# EAGLE design tin_of_fets (EAGLE 7.7.0)
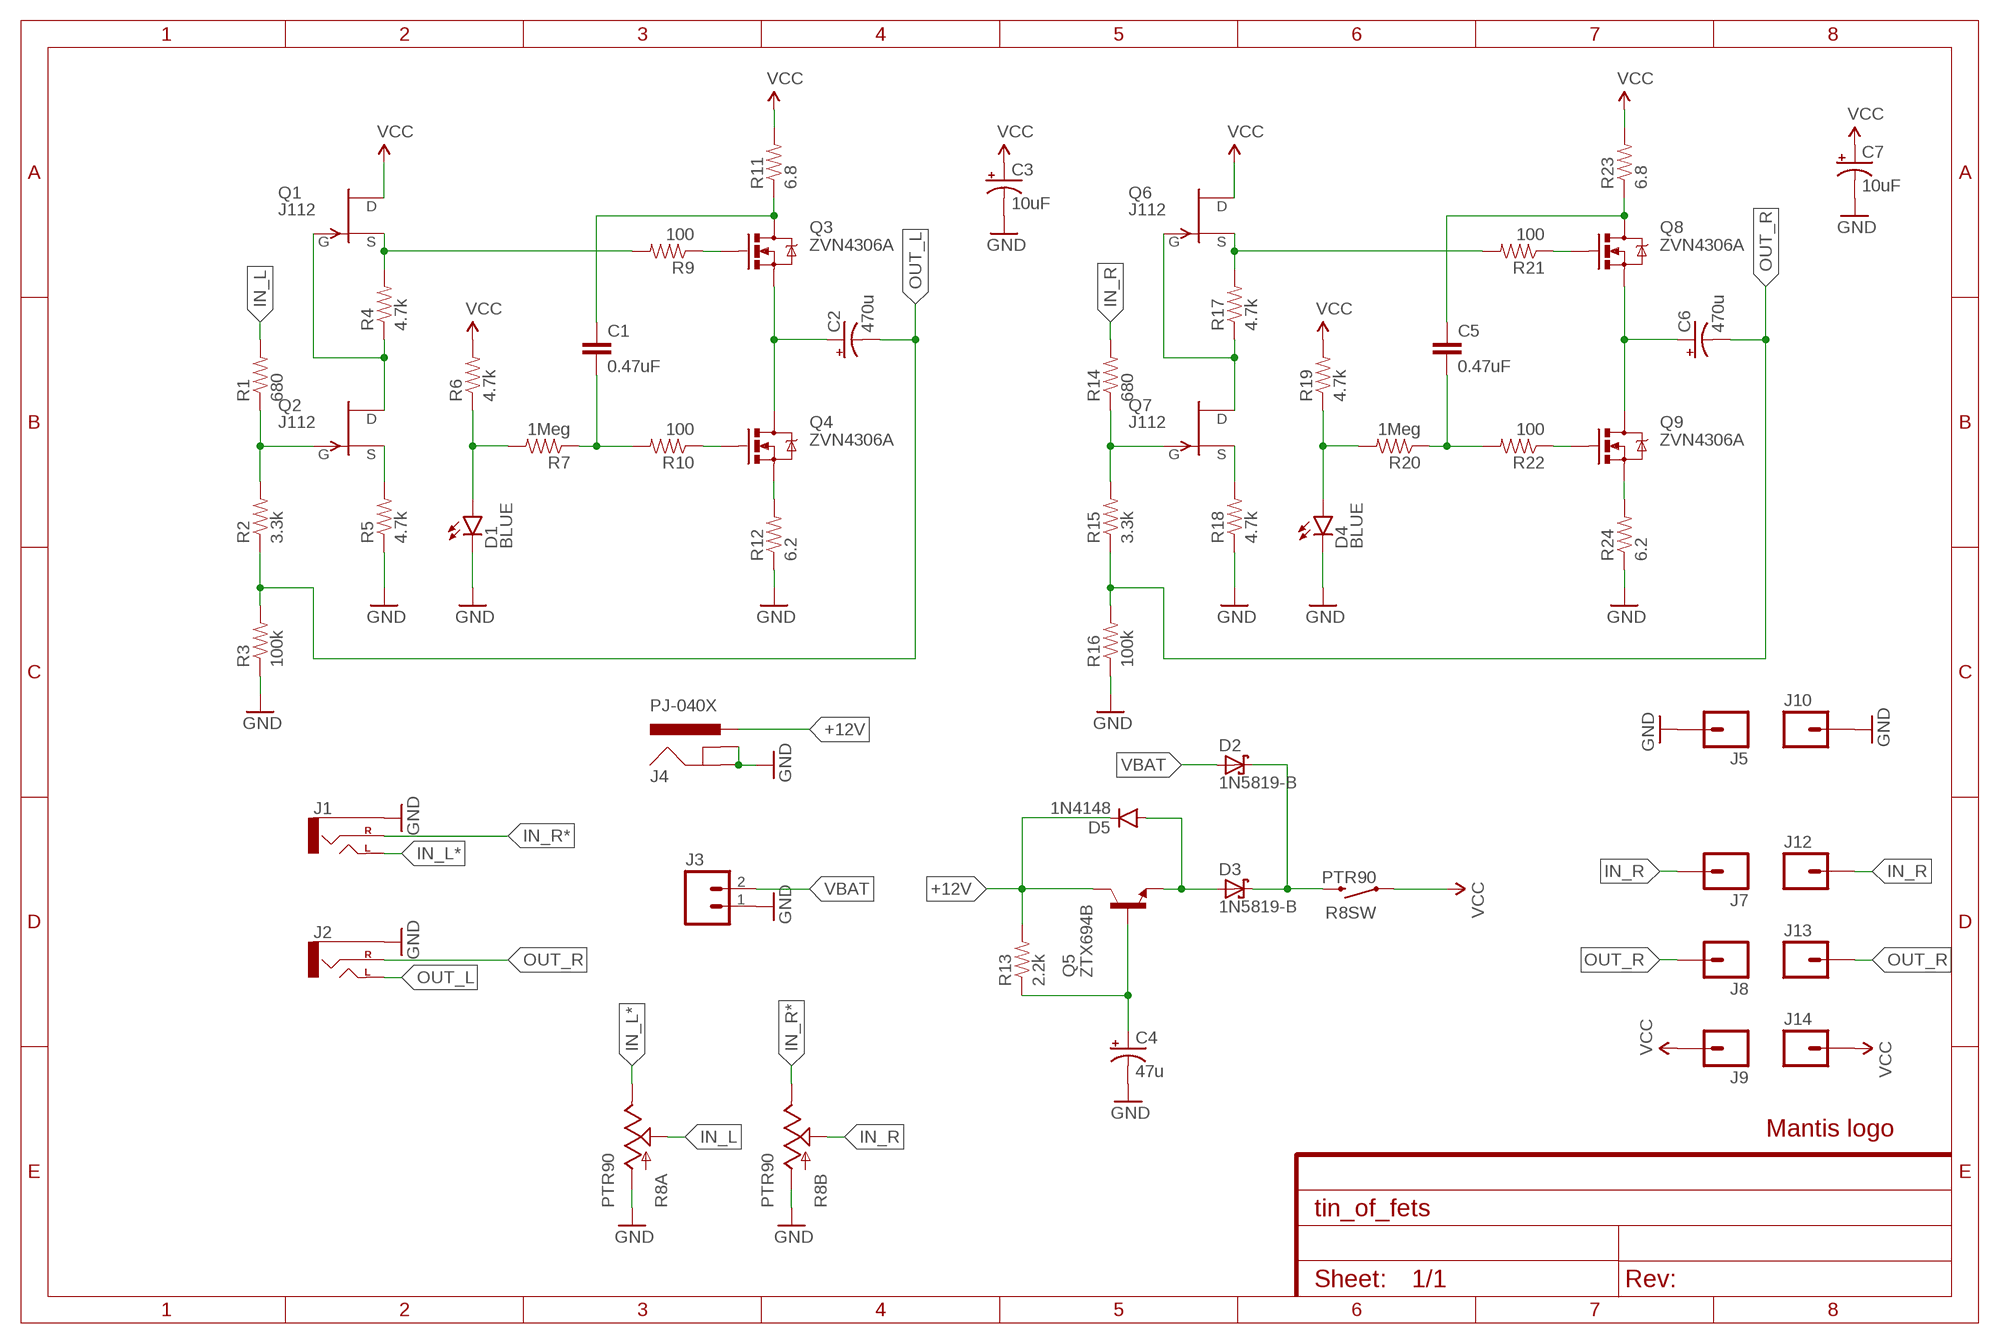
[diagram p0: schematic, sheet 1]

## Parts
C1  0.47uF  C5/3.5  [C5B3.5]
C2  470u  CAP_POLPTH8MM  [CPOL-RADIAL-8/3.5]
C3  10uF  CAP_POLPTH1-SM  [CPOL-RADIAL-10UF-25V-SM]
C4  47u  CAP_POLPTH1-SM  [CPOL-RADIAL-10UF-25V-SM]
C5  0.47uF  C5/3.5  [C5B3.5]
C6  470u  CAP_POLPTH8MM  [CPOL-RADIAL-8/3.5]
C7  10uF  CAP_POLPTH1-SM  [CPOL-RADIAL-10UF-25V-SM]
D1  BLUE  LED3MM-SM  [LED3MM-SM]
D2  1N5819-B  [DO41-7.6]
D3  1N5819-B  [DO41-7.6]
D4  BLUE  LED3MM-SM  [LED3MM-SM]
D5  1N4148  DIODE1N4148  [DIODE-1N4148]
J1  AUDIO-JACKPTH  [AUDIO-JACK]
J2  AUDIO-JACKPTH  [AUDIO-JACK]
J3  M02PTH  [1X02]
J4  PJ-040X  [PJ-040X]
J5  M01PTH  [1X01]
J7  M01PTH  [1X01]
J8  M01PTH  [1X01]
J9  M01PTH  [1X01]
J10  M01PTH  [1X01]
J12  M01PTH  [1X01]
J13  M01PTH  [1X01]
J14  M01PTH  [1X01]
LOGO1  LOGO-MANTIS  [LOGO-MANTIS]
Q1  J112  [TO-92]
Q2  J112  [TO-92]
Q3  ZVN4306A  [TO-92]
Q4  ZVN4306A  [TO-92]
Q5  ZTX694B  [TO-92]
Q6  J112  [TO-92]
Q7  J112  [TO-92]
Q8  ZVN4306A  [TO-92]
Q9  ZVN4306A  [TO-92]
R1  680  RESISTORPTH-1/4W-SM  [AXIAL-0.4-SM]
R2  3.3k  RESISTORPTH-1/4W-SM  [AXIAL-0.4-SM]
R3  100k  RESISTORPTH-1/4W-SM  [AXIAL-0.4-SM]
R4  4.7k  RESISTORPTH-1/4W-SM  [AXIAL-0.4-SM]
R5  4.7k  RESISTORPTH-1/4W-SM  [AXIAL-0.4-SM]
R6  4.7k  RESISTORPTH-1/4W-SM  [AXIAL-0.4-SM]
R7  1Meg  RESISTORPTH-1/4W-SM  [AXIAL-0.4-SM]
R8  PTR90  [PTR902]
R9  100  RESISTORPTH-1/4W-SM  [AXIAL-0.4-SM]
R10  100  RESISTORPTH-1/4W-SM  [AXIAL-0.4-SM]
R11  6.8  RESISTORPTH-1/4W-SM  [AXIAL-0.4-SM]
R12  6.2  RESISTORPTH-1/4W-SM  [AXIAL-0.4-SM]
R13  2.2k  RESISTORPTH-1/4W-SM  [AXIAL-0.4-SM]
R14  680  RESISTORPTH-1/4W-SM  [AXIAL-0.4-SM]
R15  3.3k  RESISTORPTH-1/4W-SM  [AXIAL-0.4-SM]
R16  100k  RESISTORPTH-1/4W-SM  [AXIAL-0.4-SM]
R17  4.7k  RESISTORPTH-1/4W-SM  [AXIAL-0.4-SM]
R18  4.7k  RESISTORPTH-1/4W-SM  [AXIAL-0.4-SM]
R19  4.7k  RESISTORPTH-1/4W-SM  [AXIAL-0.4-SM]
R20  1Meg  RESISTORPTH-1/4W-SM  [AXIAL-0.4-SM]
R21  100  RESISTORPTH-1/4W-SM  [AXIAL-0.4-SM]
R22  100  RESISTORPTH-1/4W-SM  [AXIAL-0.4-SM]
R23  6.8  RESISTORPTH-1/4W-SM  [AXIAL-0.4-SM]
R24  6.2  RESISTORPTH-1/4W-SM  [AXIAL-0.4-SM]

## Nets
+12V [pwr]: D5.C J4.1(PWR) Q5.3(C) R13.P$2
GND: C3.2(-) C4.2(-) C7.2(-) D1.K(C) D4.K(C) J1.SLEEVE J2.SLEEVE J3.1 J4.2(GND) J4.3(GNDBREAK) J5.1 J10.1 R3.P$1 R5.P$1 R8.R1.1(A:A) R8.R2.1(B:A) R12.P$1 R16.P$1 R18.P$1 R24.P$1
IN_L: R1.P$2 R8.R1.2(A:S)
IN_L*: J1.TIP(LEFT) R8.R1.3(A:E)
IN_R: J7.1 J12.1 R8.R2.2(B:S) R14.P$2
IN_R*: J1.RING(RIGHT) R8.R2.3(B:E)
N$1: Q1.2(S) R4.P$2 R9.P$2
N$2: Q1.3(G) Q2.1(D) R4.P$1
N$3: Q2.2(S) R5.P$2
N$4: Q6.2(S) R17.P$2 R21.P$2
N$5: Q3.2(G) R9.P$1
N$6: Q2.3(G) R1.P$1 R2.P$2
N$7: Q6.3(G) Q7.1(D) R17.P$1
N$8: Q4.2(G) R10.P$1
N$10: Q4.1(S) R12.P$2
N$11: C1.1 Q3.3(D) R11.P$1
N$12: Q7.2(S) R18.P$2
N$13: C1.2 R7.P$1 R10.P$2
N$14: D1.A R6.P$1 R7.P$2
N$15: Q7.3(G) R14.P$1 R15.P$2
N$16: Q8.2(G) R21.P$1
N$17: Q9.2(G) R22.P$1
N$19: Q9.1(S) R24.P$2
N$20: C5.1 Q8.3(D) R23.P$1
N$21: C5.2 R20.P$1 R22.P$2
N$22: D4.A R19.P$1 R20.P$2
N$23 [pwr]: D3.A D5.A Q5.1(E)
N$24: C4.1(+) Q5.2(B) R13.P$1
OUT_L: C2.2(-) J2.TIP(LEFT) R2.P$1 R3.P$2
OUT_L*: C2.1(+) Q3.1(S) Q4.3(D)
OUT_R: C6.2(-) J2.RING(RIGHT) J8.1 J13.1 R15.P$1 R16.P$2
OUT_R*: C6.1(+) Q8.1(S) Q9.3(D)
VBAT [pwr]: D2.A J3.2
VCC [pwr]: C3.1(+) C7.1(+) J9.1 J14.1 Q1.1(D) Q6.1(D) R6.P$2 R8.SW1 R11.P$2 R19.P$2 R23.P$2
VCC* [pwr]: D2.C D3.C R8.SW2

## Library data of the parts
C1 C5 = capacitor-wima:C: CAPACITOR naming: grid - package width
C2-C4 C6 C7 = my-cap:CAP_POL: Capacitor Polarized These are standard SMD and PTH capacitors. Normally 10uF, 47uF, and 100uF in electrolytic and tantalum varieties. Always verify the external diameter of the through hole cap, it varies with capacity, voltage, and manufacturer. The EIA devices should be standard.
D1 D4 = my:LED: LEDs Standard schematic elements and footprints for 5mm, 3mm, 1206, and 0603 sized LEDs. 5mm - Spark Fun Electronics SKU : COM-00529 (and others)
D2 D3 = diode:1N581*: 1.0A SCHOTTKY BARRIER RECTIFIER Source: http://www.diodes.com/datasheets/ds23001.pdf
D5 = SparkFun-DiscreteSemi:DIODE: Diode These are standard reverse protection diodes and small signal diodes. SMA package can handle up to about 1A. SOD-323 can handle about 200mA. What the SOD-323 package when ordering, there are some mfgs out there that are 5-pin packages.; PROD_ID: DIO-08378
J1 J2 = SparkFun-Connectors:AUDIO-JACK: 3.5mm Audio Jack Simple 3.5mm common PCB mount audio jack. Variant PTH is our storefront SKU PRT-08032
J3 = SparkFun-Connectors:M02: Standard 2-pin 0.1" header. Use with - straight break away headers ( PRT-00116) - right angle break away headers (PRT-00553) - swiss pins (PRT-00743) - machine pins (PRT-00117) - female headers (PRT-00115) Molex polarized connector foot print use with: PRT-08233 with associated crimp pins and housings. 2.54_SCREWTERM for use with PRT-10571. 3.5mm Screw Terminal footprints for PRT-08084 5mm Screw Terminal footprints for use with PRT-08432
J4 = my-conn:PJ-040X: CUI PJ-040x 3.8mm power jack
J5 J7-J10 J12-J14 = SparkFun-Connectors:M01: Header 1 Standard 1-pin 0.1" header. Use with straight break away headers (SKU : PRT-00116), right angle break away headers (PRT-00553), swiss pins (PRT-00743), machine pins (PRT-00117), and female headers (PRT-00115). SMTSO-256-ET is a "flush mount" nut for a 4-40 screw. The older package used to be too tight, and did not allow it to sit properly thru the drill hit. The latest (0.165DIA) fits nice and snug.
LOGO1 = my:LOGO-MANTIS: Mantis logo
Q1 Q2 Q6 Q7 = my-tran:J112
Q3 Q4 Q8 Q9 = my-tran:ZVN4306A
Q5 = my-tran:ZTX694B: NPN TRANSISTOR
R1-R7 R9-R24 = my-res:RESISTOR: Resistor Basic schematic elements and footprints for 0603, 1206, and PTH resistors.
R8 = my:PTR90: PTD90 Series - 9 mm Multi-Ganged Potentiometer

## Net classes
1 pwr: width 0.61 mm

## Board
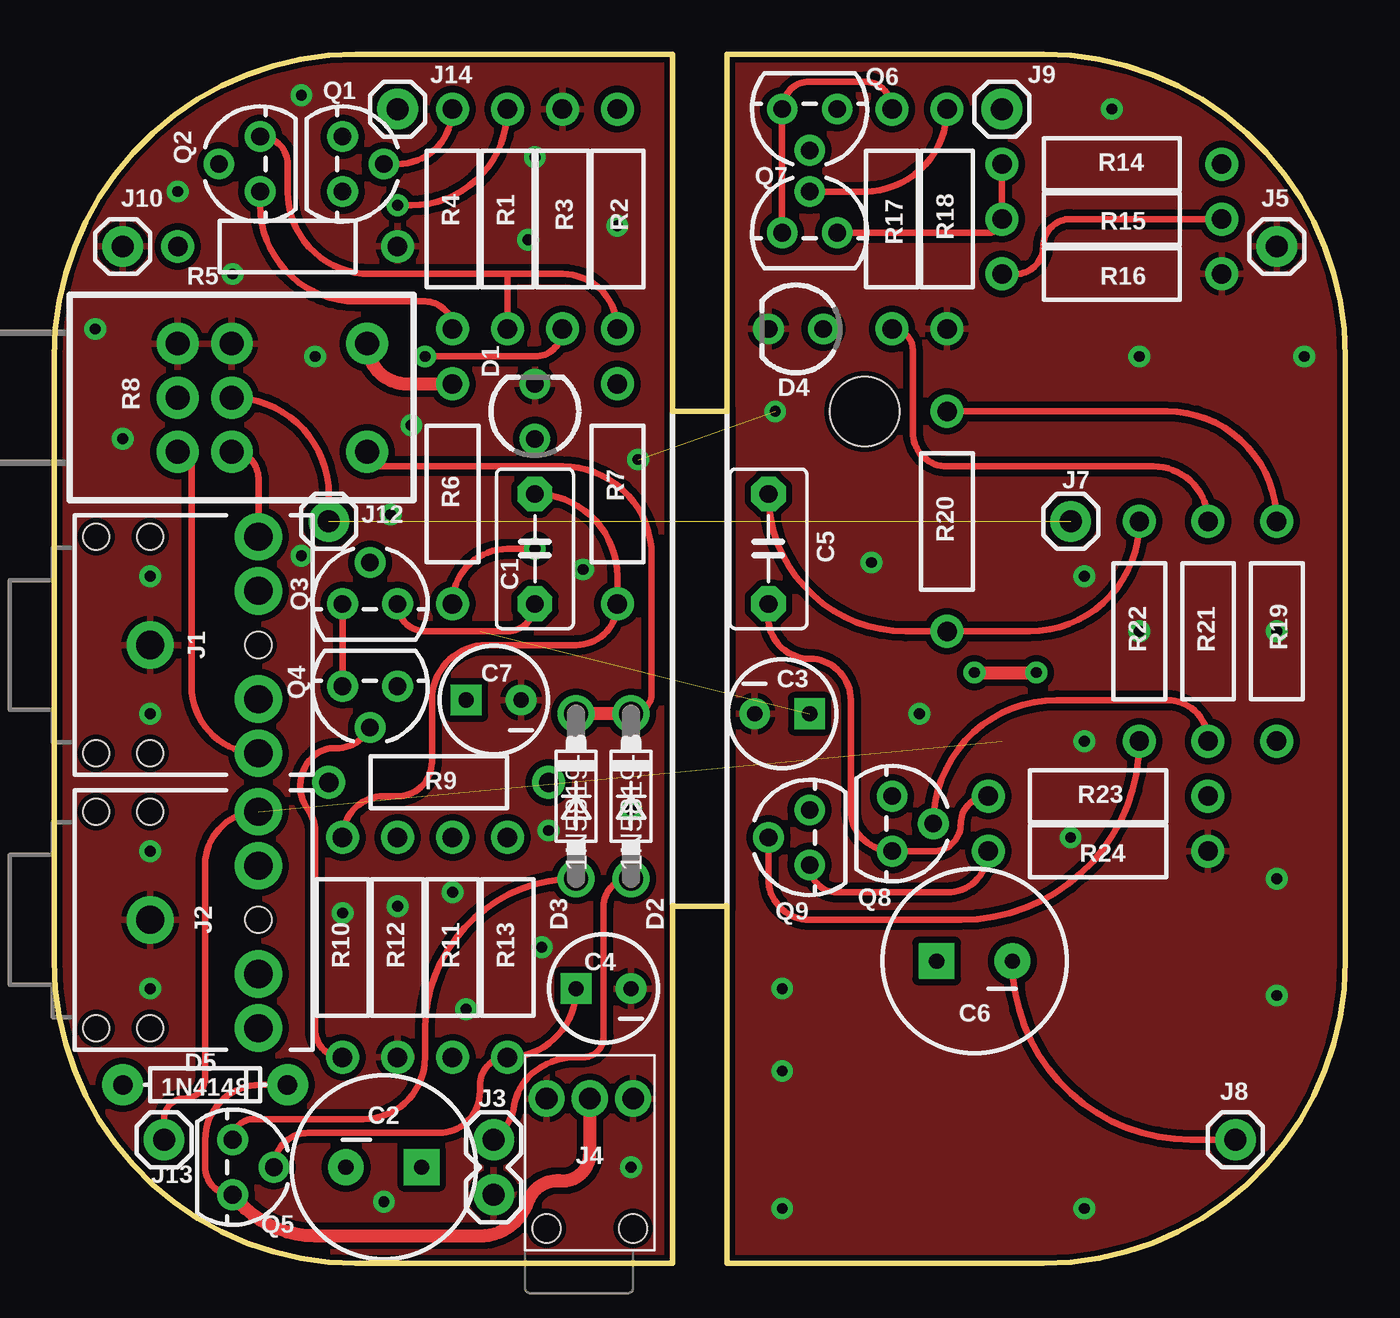
[diagram p1: board, top side]
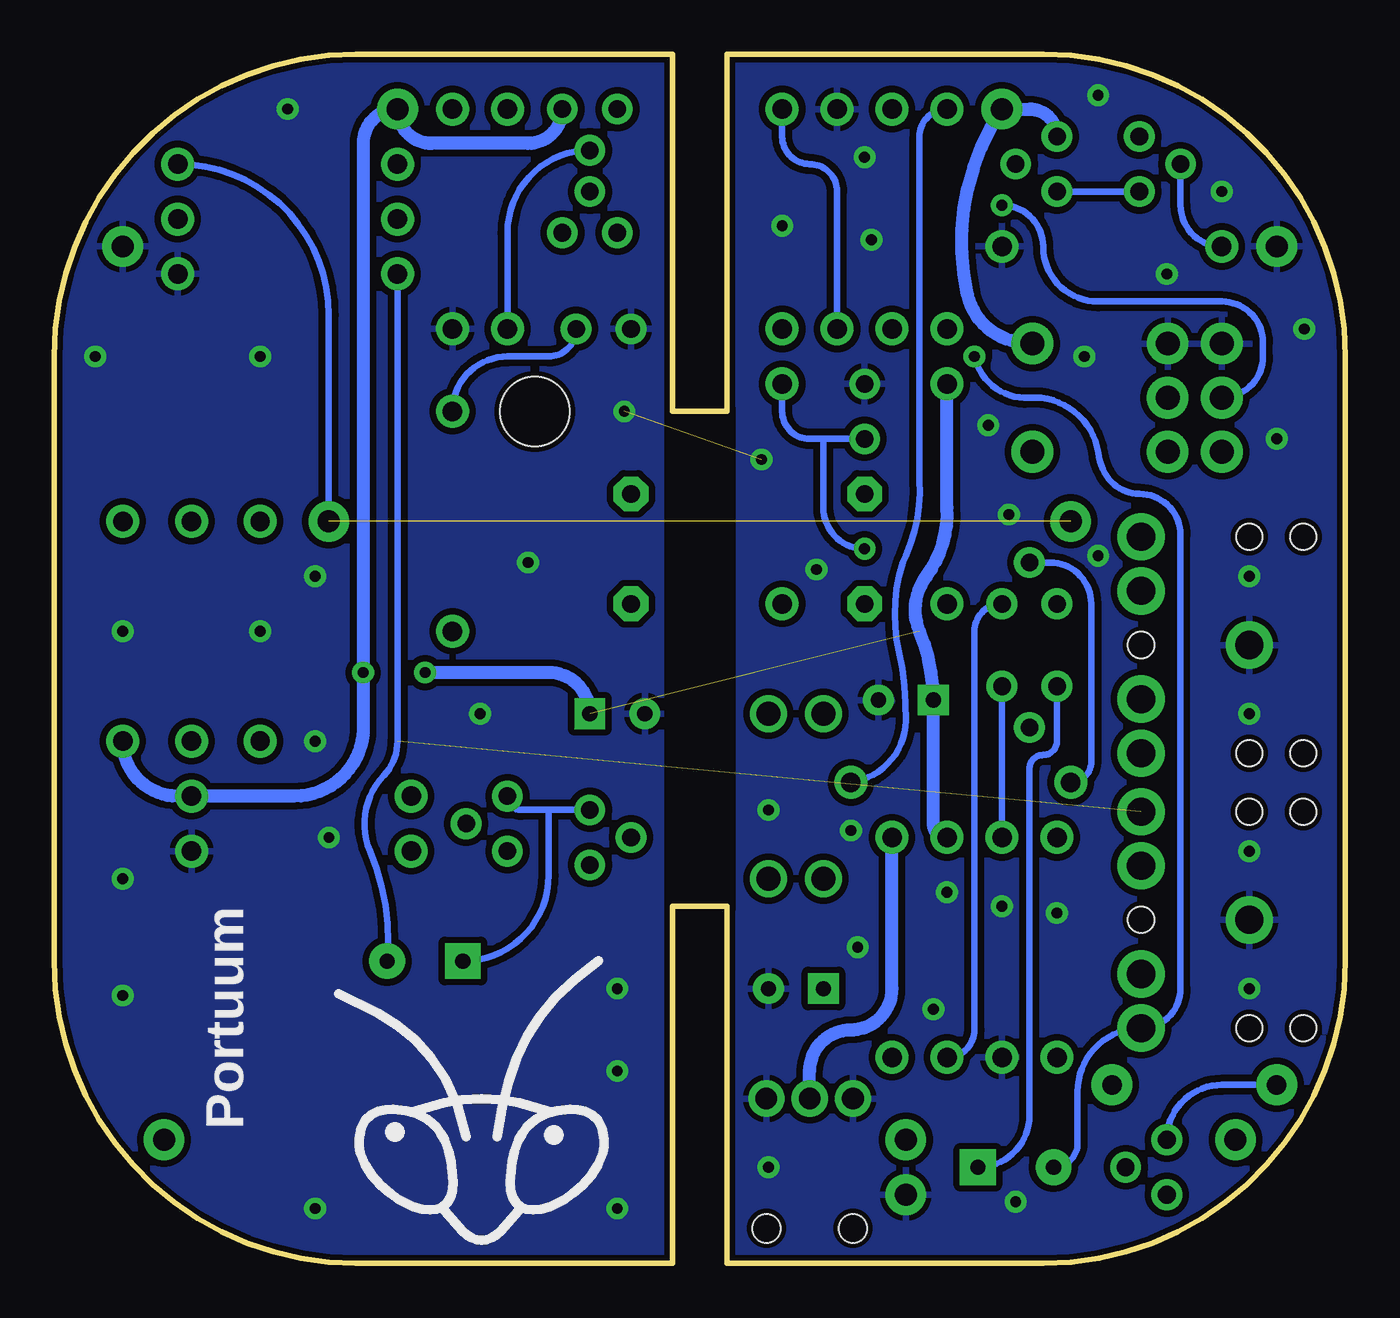
[diagram p2: board, bottom side, seen from below]

Size 59.69 x 55.88 mm. Coordinates in mm from the lower left corner, seen from the top.
Outline: 31.11,55.88 45.72,55.88 arc-90 59.69,41.91 59.69,13.97 arc-90 45.72,0 31.11,0 31.11,16.51 28.57,16.51 28.57,0 13.97,0 arc-90 0,13.97 0,41.91 arc-90 13.97,55.88 28.57,55.88 28.57,39.37 31.11,39.37 31.11,55.88
Copper layers (1*16): Top 0.035mm / dielectric 1.5mm / Bottom 0.035mm
Design rules "SeeedStudio_2layer_DRU_no_angle_20140221 *": minimum track width 12mil, minimum drill 12mil, track to track 12mil, track to pad 12mil, pad to pad 12mil, via to via 12mil, smd to smd 0mil, copper to edge 10mil, drill to drill 12mil, minimum pad ring 12mil, minimum via ring 10mil, stop-mask expansion 2mil, vias tented up to drill 100mil, thermal gap 10mil
Holes 3.2 mm at 37.47,39.37
tRestrict: 1 lines
bRestrict: 1 lines

### Footprints (pad centres in the part's own frame; a part is rotated, then mirrored left to right if it is on the bottom)
C5B3.5 = drill 0.813 pad 1.6 octagon: 1 -2.54,0; 2 2.54,0
CPOL-RADIAL-8/3.5 = drill 0.7 pad 1.651 square: 1 1.75,0 | drill 0.7 pad 1.651: 2 -1.75,0
CPOL-RADIAL-10UF-25V-SM = drill 0.7 pad 1.422 square: 1 1.27,0 | drill 0.7 pad 1.422: 2 -1.27,0
LED3MM-SM = drill 0.813 pad 1.422: A -1.27,0; K 1.27,0
DO41-7.6 = drill 1.1 pad 1.7: A 3.81,0; C -3.81,0
DIODE-1N4148 = drill 0.9 pad 1.88: A -3.81,0; C 3.81,0
AUDIO-JACK = drill 1.3 pad 2.184: RING 5,5; RSH 5,2.5; SLEEVE 0,0; TIP 5,-5; TSH 5,-2.5 | hole 1.2: 0,5; -2.5,5; -2.5,-5; 0,-5; 5,0
1X02 = drill 1.016 pad 1.88: 1 0,0; 2 2.54,0
PJ-040X = drill 1 pad 1.676: 1 0,0; 2 0,-2; 3 0,2 | hole 1.3: -6,2; -6,-2
1X01 = drill 1.016 pad 1.88: 1 0,0
TO-92 = drill 0.813 pad 1.422: 1 -1.27,0; 2 0,1.905; 3 1.27,0
AXIAL-0.4-SM = drill 0.9 pad 1.524: P$1 -5.08,0; P$2 5.08,0
PTR902 = drill 1.1 pad 1.93: R1.1 0,-2.5; R1.2 0,0; R1.3 0,2.5; R2.1 -2.5,-2.5; R2.2 -2.5,0; R2.3 -2.5,2.5; SW1 -8.75,-2.5; SW2 -8.75,2.5

### Placement (x,y rotation side)
C1  22.22,33.02 90 top
C2  15.24,4.45 0 top
C3  33.66,25.4 0 top
C4  25.4,12.7 180 top
C5  33.02,33.02 90 top
C6  42.55,13.97 180 top
C7  20.32,26.04 180 top
D1  22.22,39.37 90 top
D2  26.67,21.59 270 top
D3  24.13,21.59 270 top
D4  34.29,43.18 180 top
D5  6.99,8.26 0 top
J1  4.45,28.57 0 top
J2  4.45,15.88 0 top
J3  20.32,3.17 90 top
J4  24.76,7.62 90 top
J5  56.52,46.99 0 top
J7  46.99,34.29 0 top
J8  54.61,5.71 0 top
J9  43.82,53.34 0 top
J10  3.17,46.99 0 top
J12  12.7,34.29 0 top
J13  5.08,5.71 0 top
J14  15.88,53.34 0 top
LOGO1  40.01,7.62 0 bottom
Q1  13.34,50.8 270 top
Q2  9.53,50.8 90 top
Q3  14.61,30.48 0 top
Q4  14.61,26.67 180 top
Q5  8.26,4.45 270 top
Q6  34.93,53.34 180 top
Q7  34.93,47.62 0 top
Q8  38.73,20.32 270 top
Q9  34.93,19.68 90 top
R1  20.95,48.26 90 top
R2  26.04,48.26 270 top
R3  23.49,48.26 270 top
R4  18.41,48.26 90 top
R5  10.79,46.99 180 top
R6  18.41,35.56 90 top
R7  26.04,35.56 90 top
R8  5.71,40.01 180 top
R9  17.78,22.23 0 top
R10  13.34,14.61 90 top
R11  18.41,14.61 90 top
R12  15.88,14.61 90 top
R13  20.95,14.61 90 top
R14  48.9,50.8 0 top
R15  48.9,48.26 180 top
R16  48.9,45.72 180 top
R17  38.73,48.26 270 top
R18  41.27,48.26 90 top
R19  56.52,29.21 270 top
R20  41.27,34.29 90 top
R21  53.34,29.21 90 top
R22  50.16,29.21 90 top
R23  48.26,21.59 0 top
R24  48.26,19.05 180 top

### Tracks (layer width: path | path; a pad name or v marks a point on that pad's centre or on a via)
+12V
  Top 0.305: D5.C 9.53,8.26 arc90 6.99,5.71 6.99,4.45 arc90 Q5.3
  Top 0.61: J4.1 24.76,5.08 arc-90 23.49,3.81 arc80 21.91,2.86 arc-71 19.68,1.27 12.06,1.27 arc-53 Q5.3
  Bottom 0.61: J4.1 24.76,8.89 arc90 22.86,10.79 arc-90 20.95,12.7 R13.P$2
GND  (via drill 0.5)  (1 unrouted)
  other vias: 4.45,12.7 4.45,19.05 4.45,25.4 4.45,31.75 3.17,38.1 1.91,43.18 12.06,41.91 8.26,45.72 5.71,49.53 11.43,53.98 21.91,47.31 22.22,51.12 26.04,47.94 26.99,37.15 26.67,20.95 22.54,14.61 19.05,11.75 18.41,17.14 15.88,16.51 13.34,16.19 15.24,2.86 15.56,34.61 16.51,38.73 11.43,32.7 57.79,41.91 50.16,41.91 56.52,29.21 50.16,29.21 56.52,17.78 56.52,12.38 47.62,2.54 33.66,2.54 33.66,12.7 33.34,39.37 37.78,32.38 40.01,25.4 47.62,31.75 47.62,24.13 46.99,19.68 48.9,53.34 22.86,20 26.67,4.45 33.66,8.89 24.45,32.07
  pour Top: -0.64,55.88 60.33,55.88 60.33,0 -0.64,0
  pour Bottom: -0.64,55.88 60.07,55.88 arc-90 60.33,55.63 60.33,0 -0.38,0 arc-90 -0.64,0.25
IN_L  (via drill 0.5)
  Top 0.305: v15.88,48.9 16.51,48.9 arc90 R1.P$2
  Bottom 0.305: R8.R1.2 arc-90 3.81,41.91 3.81,42.55 arc-90 5.71,44.45 11.43,44.45 arc90 13.97,46.99 arc-90 v15.88,48.9
IN_L*
  Top 0.305: J1.TIP arc-90 6.35,26.67 6.35,36.87 arc90 R8.R1.3
IN_R  (1 unrouted)
  Top 0.305: R8.R2.2 arc-90 12.7,35.52 J12.1
  Bottom 0.305: J7.1 46.99,43.81 arc-90 R14.P$2
IN_R*
  Top 0.305: R8.R2.3 arc-90 9.45,36.27 J1.RING
N$1
  Top 0.305: Q1.2 15.88,50.8 arc90 R4.P$2
  Bottom 0.305: R4.P$2 arc-90 19.68,52.07 19.68,36.2 arc28 20.32,32.7 arc-11 20.64,31.75 arc-25 20.64,28.26 arc14 20.32,25.08 arc81 R9.P$2
N$2
  Top 0.305: R4.P$1 arc90 17.14,44.45 13.97,44.45 arc-90 9.53,48.9 Q2.1
  Bottom 0.305: Q2.1 Q1.3
N$3
  Bottom 0.305: R5.P$2 arc90 7.62,48.9 Q2.2
N$4
  Top 0.305: R21.P$2 arc90 50.8,36.83 41.27,36.83 arc-90 39.69,38.42 39.69,42.23 arc90 R17.P$2
  Bottom 0.305: Q6.2 arc-90 38.73,47.62 R17.P$2
N$5
  Bottom 0.305: Q3.2 13.65,32.38 arc90 11.75,30.48 11.75,23.18 arc90 R9.P$1
N$6
  Top 0.305: Q2.3 arc-90 10.79,50.8 10.79,49.53 arc90 14.61,45.72 20.95,45.72 | 20.95,45.72 23.49,45.72 arc-90 R2.P$2 | R1.P$1 20.95,45.72
N$7
  Top 0.305: Q7.1 Q6.3 arc-90 34.93,54.61 37.47,54.61 arc-90 R17.P$1
N$8
  Top 0.305: R10.P$1 arc-90 12.06,10.79 12.06,20 arc37 11.75,20.95 arc-88 12.06,23.5 arc-41 13.02,23.81 arc66 Q4.2
N$10
  Bottom 0.305: R12.P$2 Q4.1
N$11
  Top 0.305: C1.1 arc-90 20.95,29.21 17.14,29.21 arc-90 Q3.3
  Bottom 0.305: R11.P$1 arc-90 17.14,10.79 17.14,29.21 arc90 Q3.3
N$12
  Top 0.305: Q7.2 37.47,49.53 arc90 R18.P$2
N$13
  Top 0.305: C1.2 arc-90 26.04,31.75 R7.P$1 arc-90 24.13,28.57 20,28.57 arc90 17.46,26.04 17.46,23.18 arc-90 15.88,21.59 15.24,21.59 arc90 R10.P$2
N$14  (via drill 0.5)
  Top 0.305: R6.P$1 arc-90 20.95,33.02 v22.22,33.02
  Bottom 0.305: v22.22,33.02 arc90 24.13,34.92 24.13,38.1 | D1.A 24.13,38.1 | 24.13,38.1 24.76,38.1 arc90 26.04,39.37 R7.P$2
N$15
  Top 0.305: R14.P$1 R15.P$2 arc-90 43.18,47.62 Q7.3
N$16
  Top 0.305: Q8.2 arc-90 46.36,26.04 51.44,26.04 arc-90 R21.P$1
N$17
  Top 0.305: Q9.2 33.02,17.78 arc90 34.93,15.88 41.91,15.88 arc90 R22.P$1
N$19
  Top 0.305: Q9.1 arc90 36.2,17.14 41.27,17.14 arc90 R24.P$2
N$20
  Top 0.305: C5.1 33.02,29.84 arc90 34.93,27.94 arc-90 36.83,26.04 36.83,20.95 arc90 Q8.3 40.64,19.05 arc90 41.91,20.32 arc-90 R23.P$1
N$21
  Top 0.305: R22.P$2 arc-90 45.09,29.21 R20.P$1 39.37,29.21 arc-90 C5.2
N$22
  Top 0.305: R20.P$2 51.44,39.37 arc-90 R19.P$1
  Bottom 0.305: D4.A arc90 36.83,41.91 38.73,41.91 arc-90 R20.P$2
N$23
  Top 0.305: Q5.1 arc-90 9.21,6.67 14.29,6.67 arc90 17.14,9.53 17.14,10.79 arc-90 D3.A
  Bottom 0.305: D5.A 5.71,8.26 arc-90 Q5.1
N$24
  Top 0.305: C4.1 arc-90 R13.P$1 arc90 19.68,8.26 19.68,7.94 arc-90 17.78,6.03 11.75,6.03 arc90 Q5.2
OUT_L  (via drill 0.5)
  Top 0.305: v17.14,41.91 22.22,41.91 arc90 R3.P$2
  Bottom 0.305: R3.P$2 23.49,49.53 arc-90 24.76,50.8 arc90 26.04,52.07 R2.P$1 | v17.14,41.91 arc-82 14.61,40.01 arc85 11.43,37.47 arc-19 11.11,36.51 arc-62 9.53,35.56 arc90 7.62,33.66 7.62,12.7 arc90 J2.TIP arc-90 12.38,7.94 12.38,5.55 arc90 C2.2
OUT_L*
  Top 0.305: Q3.1 Q4.3
  Bottom 0.305: Q4.3 13.34,24.13 arc90 13.97,23.5 arc-90 14.61,22.86 14.61,6.83 arc90 C2.1
OUT_R  (1 unrouted)
  Top 0.305: R16.P$2 44.45,45.72 arc90 45.72,46.99 arc-90 46.99,48.26 R15.P$1 | J2.RING arc90 6.99,18.41 6.99,8.57 arc-90 6.03,7.62 arc90 5.08,6.67 J13.1 | C6.2 arc90 52.55,5.71 J8.1
  Bottom 0.305: R16.P$2 43.82,24.13 arc44 44.45,22.54 arc-67 45.09,19.05 arc28 C6.2
OUT_R*
  Bottom 0.305: Q9.3 36.83,20.95 | 36.83,20.95 38.1,20.95 arc90 Q8.1 | C6.1 arc-90 36.83,17.93 36.83,20.95
VBAT
  Top 0.305: J3.2 20.64,6.03 arc37 21.27,7.3 arc-46 22.22,8.89 arc-41 24.45,9.53 arc90 25.4,10.48 25.4,16.51 arc-90 D2.A
VCC  (via drill 0.5)  (1 unrouted)
  Top 0.61: R8.SW1 arc90 16.33,40.64 R6.P$2 | v42.55,27.3 v45.4,27.3
  Bottom 0.61: Q1.1 arc-90 14.61,53.34 J14.1 arc-46 17.46,44.77 arc-72 14.92,42.55 R8.SW1 | R19.P$2 arc-90 53.98,21.59 R23.P$2 48.58,21.59 arc-90 45.4,24.77 v45.4,27.3 45.4,51.75 arc90 J9.1 arc-90 42.23,51.75 37.78,51.75 arc-90 Q6.1 | C3.1 arc-90 36.83,27.3 v42.55,27.3 | R11.P$2 arc90 19.05,20.32 C7.1 arc-23 19.68,29.21 arc59 19.37,31.75 arc-40 18.41,34.92 R6.P$2
VCC*
  Top 0.305: R8.SW2 arc90 15.14,36.83 23.49,36.83 arc-90 27.62,32.7 27.62,26.35 arc-90 D2.C
  Top 0.61: D2.C D3.C

### Text on the board
bPlace: Portuum